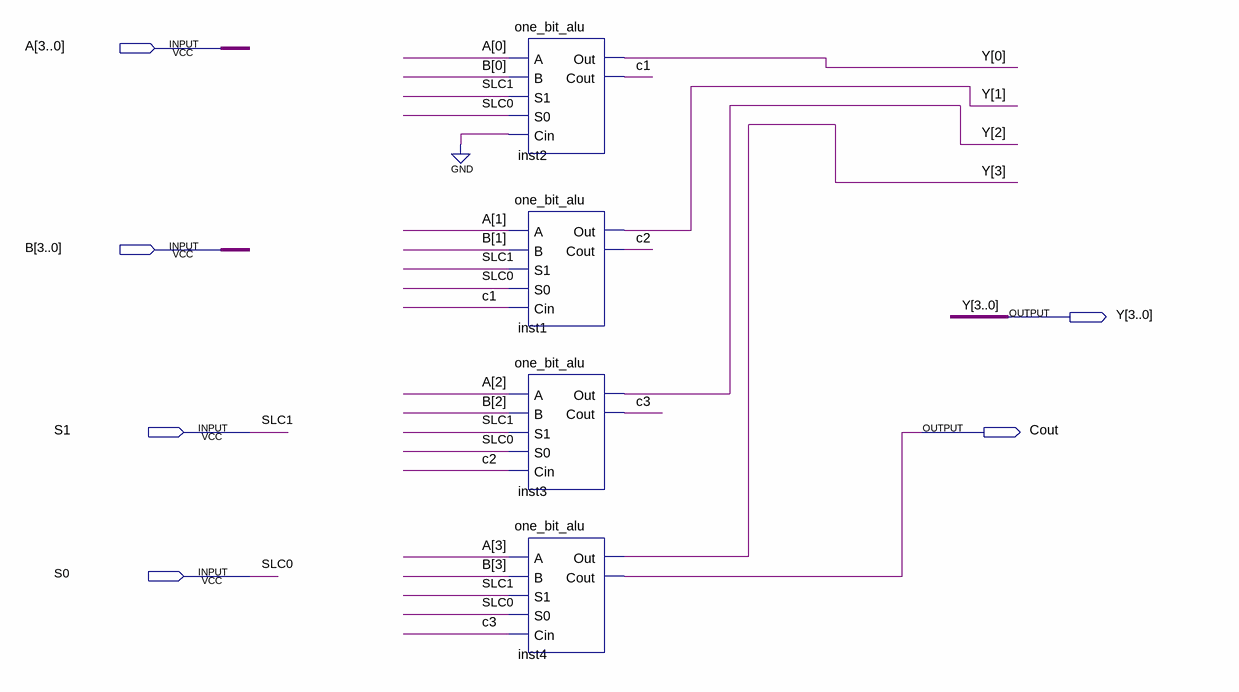
[diagram p0: schematic sheet]
// Quartus schematic four_bit_alu.bdf as structural Verilog: 4 symbols, 6 pins
module four_bit_alu (
  input  [3:0] A,
  input  [3:0] B,
  input  S1,
  input  S0,
  output [3:0] Y,
  output Cout
);

  wire c1, c2, c3;

  one_bit_alu inst2 (.A(A[0]), .B(B[0]), .S1(S1), .S0(S0), .Cin(1'b0), .Out(Y[0]), .Cout(c1));
  one_bit_alu inst1 (.A(A[1]), .B(B[1]), .S1(S1), .S0(S0), .Cin(c1), .Out(Y[1]), .Cout(c2));
  one_bit_alu inst3 (.A(A[2]), .B(B[2]), .S1(S1), .S0(S0), .Cin(c2), .Out(Y[2]), .Cout(c3));
  one_bit_alu inst4 (.A(A[3]), .B(B[3]), .S1(S1), .S0(S0), .Cin(c3), .Out(Y[3]), .Cout(Cout));

  // Other names for the same wires on the sheet: SLC0 = S0; SLC1 = S1
endmodule
